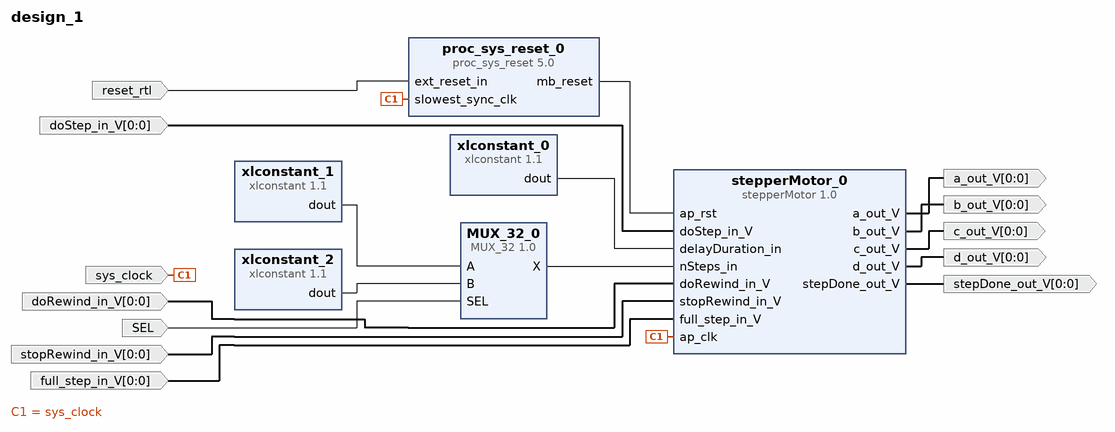
[diagram p0: block diagram of the top level]
# Vivado block design design_1, Vivado 2014.4
create_bd_design design_1

create_bd_port -dir O -from 0 -to 0 -type data b_out_V
create_bd_port -dir O -from 0 -to 0 -type data c_out_V
create_bd_port -dir O -from 0 -to 0 -type data a_out_V
create_bd_port -dir O -from 0 -to 0 -type data d_out_V
create_bd_port -dir O -from 0 -to 0 -type data stepDone_out_V
create_bd_port -dir I -from 0 -to 0 -type data doStep_in_V
set_property -dict [list \
  CONFIG.LAYERED_METADATA {xilinx.com:interface:datatypes:1.0 {DATA {datatype {name {attribs {resolve_type immediate dependency {} format string minimum {} maximum {}} value {}} bitwidth {attribs {resolve_type immediate dependency {} format long minimum {} maximum {}} value 1} bitoffset {attribs {resolve_type immediate dependency {} format long minimum {} maximum {}} value 0} integer {signed {attribs {resolve_type immediate dependency {} format bool minimum {} maximum {}} value false}}}}}} \
] [get_bd_ports doStep_in_V]
create_bd_port -dir I -from 0 -to 0 -type data doRewind_in_V
set_property -dict [list \
  CONFIG.LAYERED_METADATA {xilinx.com:interface:datatypes:1.0 {DATA {datatype {name {attribs {resolve_type immediate dependency {} format string minimum {} maximum {}} value {}} bitwidth {attribs {resolve_type immediate dependency {} format long minimum {} maximum {}} value 1} bitoffset {attribs {resolve_type immediate dependency {} format long minimum {} maximum {}} value 0} integer {signed {attribs {resolve_type immediate dependency {} format bool minimum {} maximum {}} value false}}}}}} \
] [get_bd_ports doRewind_in_V]
create_bd_port -dir I -from 0 -to 0 -type data stopRewind_in_V
set_property -dict [list \
  CONFIG.LAYERED_METADATA {xilinx.com:interface:datatypes:1.0 {DATA {datatype {name {attribs {resolve_type immediate dependency {} format string minimum {} maximum {}} value {}} bitwidth {attribs {resolve_type immediate dependency {} format long minimum {} maximum {}} value 1} bitoffset {attribs {resolve_type immediate dependency {} format long minimum {} maximum {}} value 0} integer {signed {attribs {resolve_type immediate dependency {} format bool minimum {} maximum {}} value false}}}}}} \
] [get_bd_ports stopRewind_in_V]
create_bd_port -dir I -type clk sys_clock
set_property -dict {CONFIG.FREQ_HZ 100000000 CONFIG.PHASE 0.000} [get_bd_ports sys_clock]
create_bd_port -dir I -type rst reset_rtl
set_property -dict {CONFIG.POLARITY ACTIVE_LOW} [get_bd_ports reset_rtl]
create_bd_port -dir I SEL
create_bd_port -dir I -from 0 -to 0 -type data full_step_in_V
set_property -dict [list \
  CONFIG.LAYERED_METADATA {xilinx.com:interface:datatypes:1.0 {DATA {datatype {name {attribs {resolve_type immediate dependency {} format string minimum {} maximum {}} value {}} bitwidth {attribs {resolve_type immediate dependency {} format long minimum {} maximum {}} value 1} bitoffset {attribs {resolve_type immediate dependency {} format long minimum {} maximum {}} value 0} integer {signed {attribs {resolve_type immediate dependency {} format bool minimum {} maximum {}} value false}}}}}} \
] [get_bd_ports full_step_in_V]

create_bd_cell -type ip -vlnv xilinx.com:ip:xlconstant:1.1 xlconstant_0
set_property -dict {CONFIG.CONST_WIDTH 32 CONFIG.CONST_VAL 5000000} [get_bd_cells xlconstant_0]
create_bd_cell -type ip -vlnv xilinx.com:ip:xlconstant:1.1 xlconstant_1
set_property -dict {CONFIG.CONST_WIDTH 32} [get_bd_cells xlconstant_1]
create_bd_cell -type ip -vlnv xilinx.com:ip:proc_sys_reset:5.0 proc_sys_reset_0
create_bd_cell -type ip -vlnv xilinx.com:ip:MUX_32:1.0 MUX_32_0
create_bd_cell -type ip -vlnv xilinx.com:ip:xlconstant:1.1 xlconstant_2
set_property -dict {CONFIG.CONST_WIDTH 32 CONFIG.CONST_VAL 200} [get_bd_cells xlconstant_2]
create_bd_cell -type ip -vlnv xilinx.com:hls:stepperMotor:1.0 stepperMotor_0

# ---- connections ----

connect_bd_net [get_bd_pins stepperMotor_0/b_out_V] [get_bd_ports b_out_V]
connect_bd_net [get_bd_pins stepperMotor_0/c_out_V] [get_bd_ports c_out_V]
connect_bd_net [get_bd_pins stepperMotor_0/a_out_V] [get_bd_ports a_out_V]
connect_bd_net [get_bd_pins stepperMotor_0/d_out_V] [get_bd_ports d_out_V]
connect_bd_net [get_bd_pins stepperMotor_0/stepDone_out_V] [get_bd_ports stepDone_out_V]
connect_bd_net [get_bd_pins xlconstant_0/dout] [get_bd_pins stepperMotor_0/delayDuration_in]
connect_bd_net [get_bd_ports doStep_in_V] [get_bd_pins stepperMotor_0/doStep_in_V]
connect_bd_net [get_bd_ports doRewind_in_V] [get_bd_pins stepperMotor_0/doRewind_in_V]
connect_bd_net [get_bd_ports stopRewind_in_V] [get_bd_pins stepperMotor_0/stopRewind_in_V]
connect_bd_net [get_bd_ports sys_clock] [get_bd_pins proc_sys_reset_0/slowest_sync_clk] [get_bd_pins stepperMotor_0/ap_clk]
connect_bd_net [get_bd_ports reset_rtl] [get_bd_pins proc_sys_reset_0/ext_reset_in]
connect_bd_net [get_bd_pins proc_sys_reset_0/mb_reset] [get_bd_pins stepperMotor_0/ap_rst]
connect_bd_net [get_bd_pins MUX_32_0/X] [get_bd_pins stepperMotor_0/nSteps_in]
connect_bd_net [get_bd_pins xlconstant_1/dout] [get_bd_pins MUX_32_0/A]
connect_bd_net [get_bd_pins xlconstant_2/dout] [get_bd_pins MUX_32_0/B]
connect_bd_net [get_bd_ports SEL] [get_bd_pins MUX_32_0/SEL]
connect_bd_net [get_bd_ports full_step_in_V] [get_bd_pins stepperMotor_0/full_step_in_V]

validate_bd_design
save_bd_design
